# Altium schematic sheet ReiAccept_RaspberryPiZeroKeyboard__pcb_Old_AltiumDesigner__main.schdoc
size 519 x 360 mm
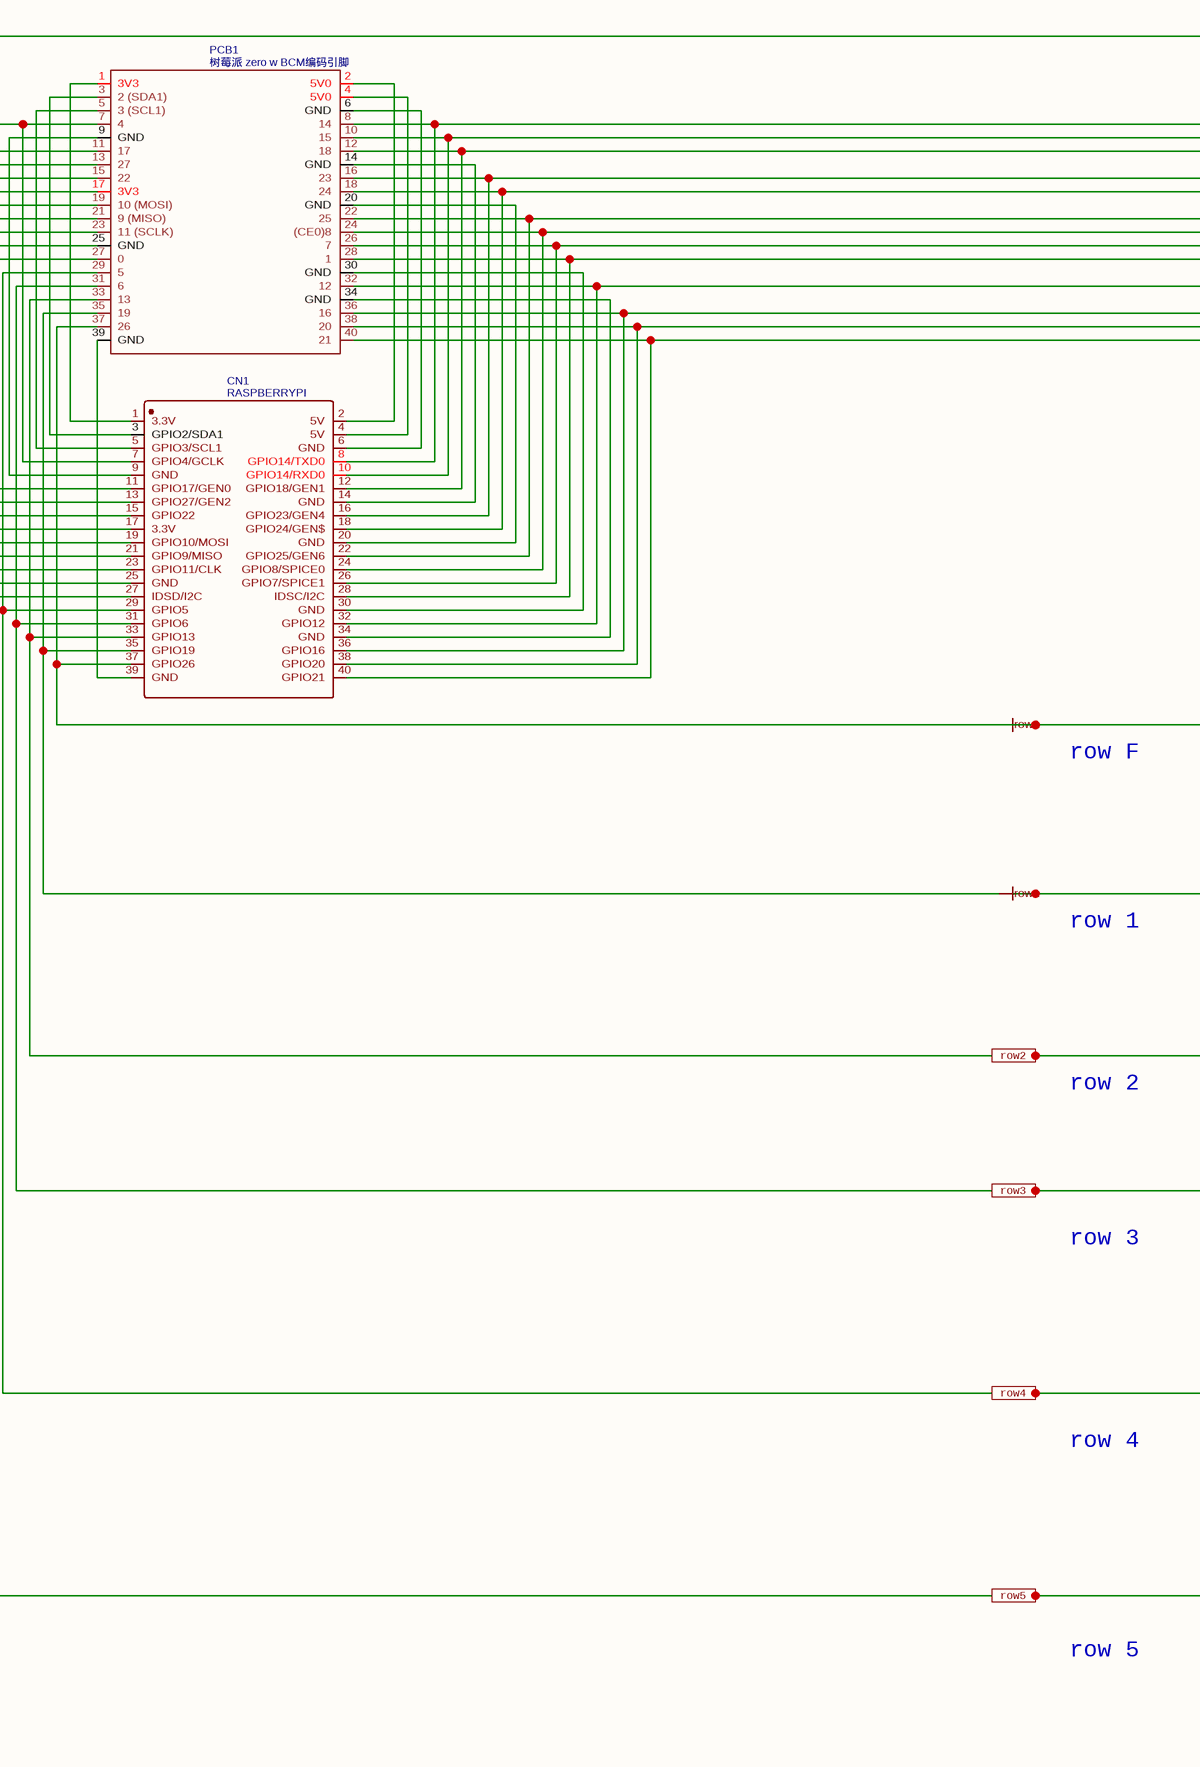
[diagram p0: ReiAccept_RaspberryPiZeroKeyboard__pcb_Old_AltiumDesigner__main.schdoc, left]
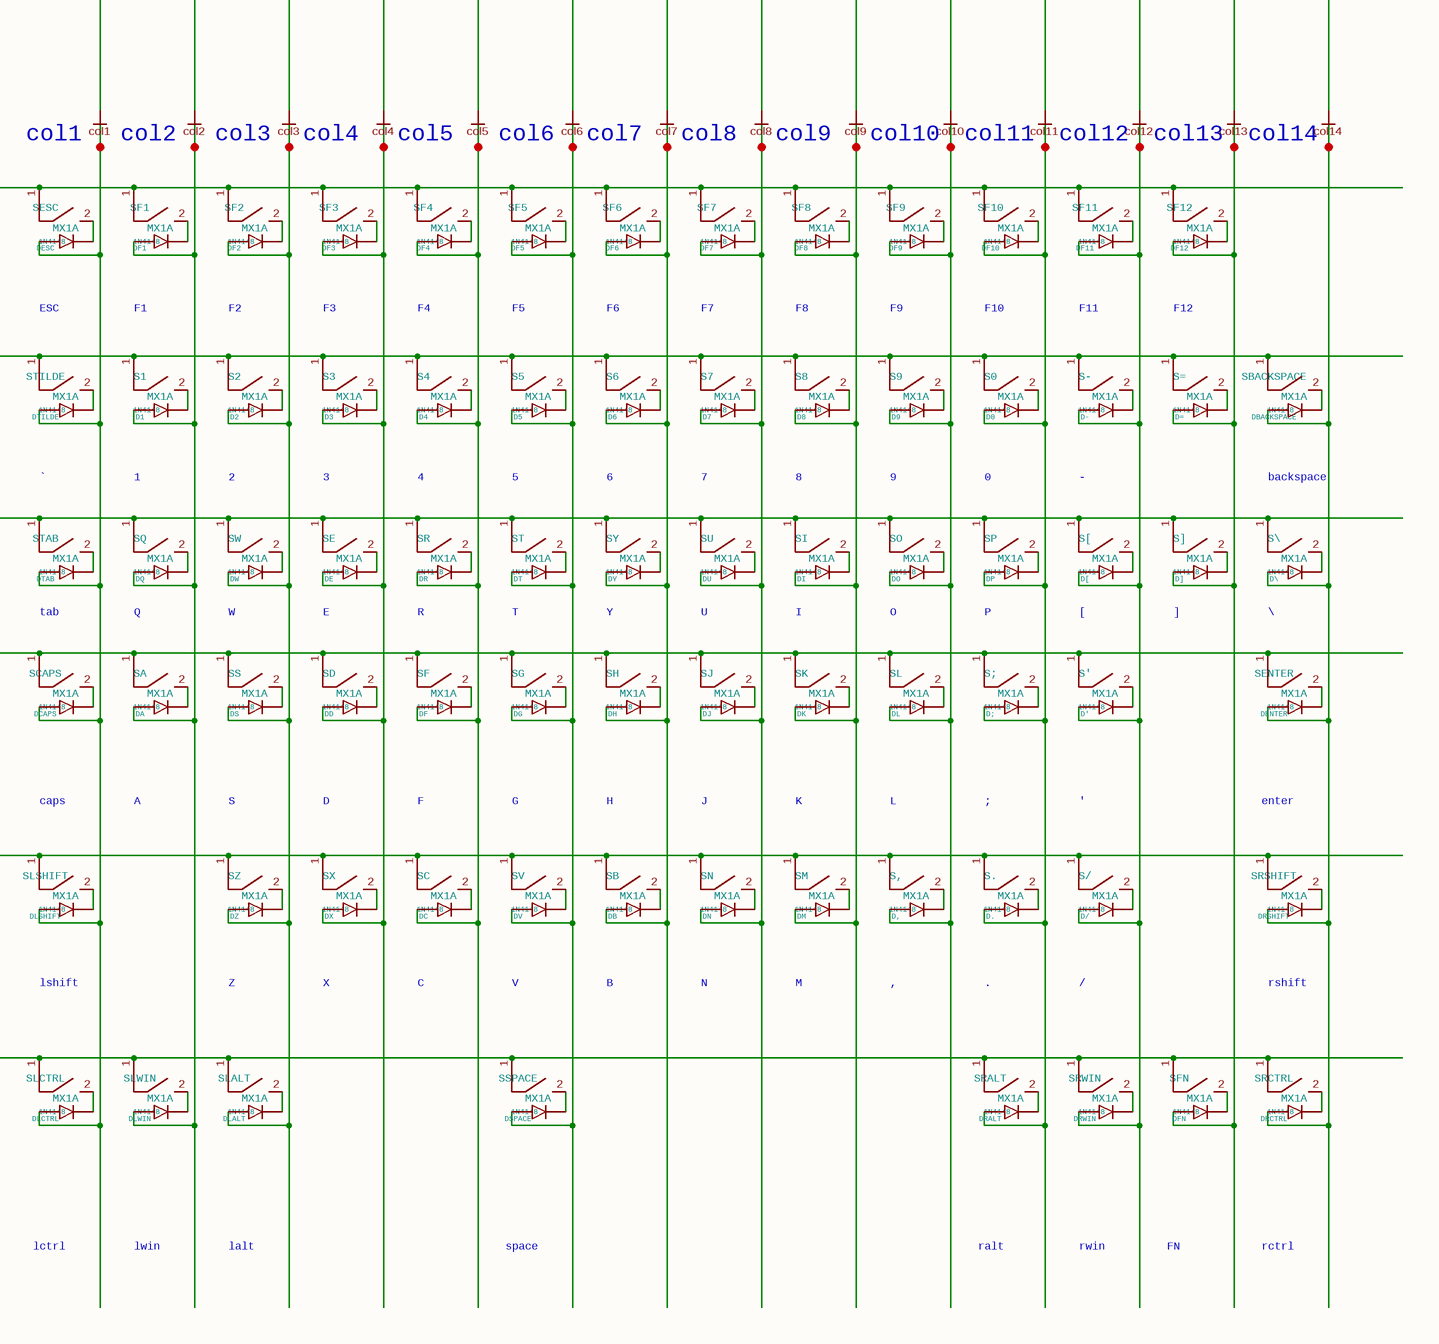
[diagram p1: ReiAccept_RaspberryPiZeroKeyboard__pcb_Old_AltiumDesigner__main.schdoc, right]

## Parts
CN1  RASPBERRYPI  [HDR-IDC-2.54-2X20P]
D0  1N4148  [0805D]
D1  1N4148  [0805D]
D2  1N4148  [0805D]
D3  1N4148  [0805D]
D4  1N4148  [0805D]
D5  1N4148  [0805D]
D6  1N4148  [0805D]
D7  1N4148  [0805D]
D8  1N4148  [0805D]
D9  1N4148  [0805D]
D'  1N4148  [0805D]
D,  1N4148  [0805D]
D-  1N4148  [0805D]
D.  1N4148  [0805D]
D/  1N4148  [0805D]
D;  1N4148  [0805D]
D=  1N4148  [0805D]
D[  1N4148  [0805D]
D\  1N4148  [0805D]
D]  1N4148  [0805D]
DA  1N4148  [0805D]
DB  1N4148  [0805D]
DBACKSPACE  1N4148  [0805D]
DC  1N4148  [0805D]
DCAPS  1N4148  [0805D]
DD  1N4148  [0805D]
DE  1N4148  [0805D]
DENTER  1N4148  [0805D]
DESC  1N4148  [0805D]
DF  1N4148  [0805D]
DF1  1N4148  [0805D]
DF2  1N4148  [0805D]
DF3  1N4148  [0805D]
DF4  1N4148  [0805D]
DF5  1N4148  [0805D]
DF6  1N4148  [0805D]
DF7  1N4148  [0805D]
DF8  1N4148  [0805D]
DF9  1N4148  [0805D]
DF10  1N4148  [0805D]
DF11  1N4148  [0805D]
DF12  1N4148  [0805D]
DFN  1N4148  [0805D]
DG  1N4148  [0805D]
DH  1N4148  [0805D]
DI  1N4148  [0805D]
DJ  1N4148  [0805D]
DK  1N4148  [0805D]
DL  1N4148  [0805D]
DLALT  1N4148  [0805D]
DLCTRL  1N4148  [0805D]
DLSHIFT  1N4148  [0805D]
DLWIN  1N4148  [0805D]
DM  1N4148  [0805D]
DN  1N4148  [0805D]
DO  1N4148  [0805D]
DP  1N4148  [0805D]
DQ  1N4148  [0805D]
DR  1N4148  [0805D]
DRALT  1N4148  [0805D]
DRCTRL  1N4148  [0805D]
DRSHIFT  1N4148  [0805D]
DRWIN  1N4148  [0805D]
DS  1N4148  [0805D]
DSPACE  1N4148  [0805D]
DT  1N4148  [0805D]
DTAB  1N4148  [0805D]
DTILDE  1N4148  [0805D]
DU  1N4148  [0805D]
DV  1N4148  [0805D]
DW  1N4148  [0805D]
DX  1N4148  [0805D]
DY  1N4148  [0805D]
DZ  1N4148  [0805D]
PCB1  树莓派 zero w BCM编码引脚  [RASPBERRY PI ZERO (FACE UP) OUTLINE]
S0  MX1A  [MX1A]
S1  MX1A  [MX1A]
S2  MX1A  [MX1A]
S3  MX1A  [MX1A]
S4  MX1A  [MX1A]
S5  MX1A  [MX1A]
S6  MX1A  [MX1A]
S7  MX1A  [MX1A]
S8  MX1A  [MX1A]
S9  MX1A  [MX1A]
S'  MX1A  [MX1A]
S,  MX1A  [MX1A]
S-  MX1A  [MX1A]
S.  MX1A  [MX1A]
S/  MX1A  [MX1A]
S;  MX1A  [MX1A]
S=  MX1A  [MX1A]
S[  MX1A  [MX1A]
S\  MX1A  [MX1A]
S]  MX1A  [MX1A]
SA  MX1A  [MX1A]
SB  MX1A  [MX1A]
SBACKSPACE  MX1A  [MX1A]
SC  MX1A  [MX1A]
SCAPS  MX1A  [MX1A]
SD  MX1A  [MX1A]
SE  MX1A  [MX1A]
SENTER  MX1A  [MX1A]
SESC  MX1A  [MX1A]
SF  MX1A  [MX1A]
SF1  MX1A  [MX1A]
SF2  MX1A  [MX1A]
SF3  MX1A  [MX1A]
SF4  MX1A  [MX1A]
SF5  MX1A  [MX1A]
SF6  MX1A  [MX1A]
SF7  MX1A  [MX1A]
SF8  MX1A  [MX1A]
SF9  MX1A  [MX1A]
SF10  MX1A  [MX1A]
SF11  MX1A  [MX1A]
SF12  MX1A  [MX1A]
SFN  MX1A  [MX1A_NO3D]
SG  MX1A  [MX1A]
SH  MX1A  [MX1A]
SI  MX1A  [MX1A]
SJ  MX1A  [MX1A]
SK  MX1A  [MX1A]
SL  MX1A  [MX1A]
SLALT  MX1A  [MX1A]
SLCTRL  MX1A  [MX1A]
SLSHIFT  MX1A  [MX1A]
SLWIN  MX1A  [MX1A]
SM  MX1A  [MX1A]
SN  MX1A  [MX1A]
SO  MX1A  [MX1A]
SP  MX1A  [MX1A]
SQ  MX1A  [MX1A]
SR  MX1A  [MX1A]
SRALT  MX1A  [MX1A]
SRCTRL  MX1A  [MX1A_NO3D]
SRSHIFT  MX1A  [MX1A]
SRWIN  MX1A  [MX1A]
SS  MX1A  [MX1A]
SSPACE  MX1A  [MX1A_NO3D]
ST  MX1A  [MX1A]
STAB  MX1A  [MX1A]
STILDE  MX1A  [MX1A]
SU  MX1A  [MX1A]
SV  MX1A  [MX1A]
SW  MX1A  [MX1A]
SX  MX1A  [MX1A]
SY  MX1A  [MX1A]
SZ  MX1A  [MX1A]

## Ports
row2 (in), row3 (in), row4 (in), row5 (in)

## Nets
col1: CN1.40(GPIO21) DCAPS.1(A) DESC.1(A) DLCTRL.1(A) DLSHIFT.1(A) DTAB.1(A) DTILDE.1(A) PCB1.40(21)
col2: CN1.38(GPIO20) D1.1(A) DA.1(A) DF1.1(A) DLWIN.1(A) DQ.1(A) PCB1.38(20)
col3: CN1.36(GPIO16) D2.1(A) DF2.1(A) DLALT.1(A) DS.1(A) DW.1(A) DZ.1(A) PCB1.36(16)
col4: CN1.32(GPIO12) D3.1(A) DD.1(A) DE.1(A) DF3.1(A) DX.1(A) PCB1.32(12)
col5: CN1.28(IDSC/I2C) D4.1(A) DC.1(A) DF.1(A) DF4.1(A) DR.1(A) PCB1.28(1)
col6: CN1.26(GPIO7/SPICE1) D5.1(A) DF5.1(A) DG.1(A) DSPACE.1(A) DT.1(A) DV.1(A) PCB1.26(7)
col7: CN1.24(GPIO8/SPICE0) D6.1(A) DB.1(A) DF6.1(A) DH.1(A) DY.1(A) PCB1.24((CE0)8)
col8: CN1.22(GPIO25/GEN6) D7.1(A) DF7.1(A) DJ.1(A) DN.1(A) DU.1(A) PCB1.22(25)
col9: CN1.18(GPIO24/GEN$) D8.1(A) DF8.1(A) DI.1(A) DK.1(A) DM.1(A) PCB1.18(24)
col10: CN1.16(GPIO23/GEN4) D9.1(A) D,.1(A) DF9.1(A) DL.1(A) DO.1(A) PCB1.16(23)
col11: CN1.12(GPIO18/GEN1) D0.1(A) D..1(A) D;.1(A) DF10.1(A) DP.1(A) DRALT.1(A) PCB1.12(18)
col12: CN1.10(GPIO14/RXD0) D'.1(A) D-.1(A) D/.1(A) D[.1(A) DF11.1(A) DRWIN.1(A) PCB1.10(15)
col13: CN1.8(GPIO14/TXD0) D=.1(A) D].1(A) DF12.1(A) DFN.1(A) PCB1.8(14)
col14: CN1.7(GPIO4/GCLK) D\.1(A) DBACKSPACE.1(A) DENTER.1(A) DRCTRL.1(A) DRSHIFT.1(A) PCB1.7(4)
row1: CN1.35(GPIO19) CN1.37(GPIO26) PCB1.35(19) PCB1.37(26) S0.1 S1.1 S2.1 S3.1 S4.1 S5.1 S6.1 S7.1 S8.1 S9.1 S-.1 S=.1 SBACKSPACE.1 SESC.1 SF1.1 SF2.1 SF3.1 SF4.1 SF5.1 SF6.1 SF7.1 SF8.1 SF9.1 SF10.1 SF11.1 SF12.1 STILDE.1
row2: CN1.33(GPIO13) PCB1.33(13) S[.1 S\.1 S].1 SE.1 SI.1 SO.1 SP.1 SQ.1 SR.1 ST.1 STAB.1 SU.1 SW.1 SY.1 ; port row2
row3: CN1.31(GPIO6) PCB1.31(6) S'.1 S;.1 SA.1 SCAPS.1 SD.1 SENTER.1 SF.1 SG.1 SH.1 SJ.1 SK.1 SL.1 SS.1 ; port row3
row4: CN1.29(GPIO5) PCB1.29(5) S,.1 S..1 S/.1 SB.1 SC.1 SLSHIFT.1 SM.1 SN.1 SRSHIFT.1 SV.1 SX.1 SZ.1 ; port row4
row5: CN1.27(IDSD/I2C) PCB1.27(0) SFN.1 SLALT.1 SLCTRL.1 SLWIN.1 SRALT.1 SRCTRL.1 SRWIN.1 SSPACE.1 ; port row5
NetCN1_1: CN1.1(3.3V) PCB1.1(3V3)
NetCN1_2: CN1.2(5V) PCB1.2(5V0)
NetCN1_3: CN1.3(GPIO2/SDA1) PCB1.3(2_(SDA1))
NetCN1_4: CN1.4(5V) PCB1.4(5V0)
NetCN1_5: CN1.5(GPIO3/SCL1) PCB1.5(3_(SCL1))
NetCN1_6: CN1.6(GND) PCB1.6(GND)
NetCN1_9: CN1.9(GND) PCB1.9(GND)
NetCN1_11: CN1.11(GPIO17/GEN0) PCB1.11(17)
NetCN1_13: CN1.13(GPIO27/GEN2) PCB1.13(27)
NetCN1_14: CN1.14(GND) PCB1.14(GND)
NetCN1_15: CN1.15(GPIO22) PCB1.15(22)
NetCN1_17: CN1.17(3.3V) PCB1.17(3V3)
NetCN1_19: CN1.19(GPIO10/MOSI) PCB1.19(10_(MOSI))
NetCN1_20: CN1.20(GND) PCB1.20(GND)
NetCN1_21: CN1.21(GPIO9/MISO) PCB1.21(9_(MISO))
NetCN1_23: CN1.23(GPIO11/CLK) PCB1.23(11_(SCLK))
NetCN1_25: CN1.25(GND) PCB1.25(GND)
NetCN1_30: CN1.30(GND) PCB1.30(GND)
NetCN1_34: CN1.34(GND) PCB1.34(GND)
NetCN1_39: CN1.39(GND) PCB1.39(GND)
NetD0_2: D0.2(K) S0.2
NetD1_2: D1.2(K) S1.2
NetD2_2: D2.2(K) S2.2
NetD3_2: D3.2(K) S3.2
NetD4_2: D4.2(K) S4.2
NetD5_2: D5.2(K) S5.2
NetD6_2: D6.2(K) S6.2
NetD7_2: D7.2(K) S7.2
NetD8_2: D8.2(K) S8.2
NetD9_2: D9.2(K) S9.2
NetD'_2: D'.2(K) S'.2
NetD,_2: D,.2(K) S,.2
NetD-_2: D-.2(K) S-.2
NetD._2: D..2(K) S..2
NetD/_2: D/.2(K) S/.2
NetD;_2: D;.2(K) S;.2
NetD=_2: D=.2(K) S=.2
NetD[_2: D[.2(K) S[.2
Net~{D}_2: D\.2(K) S\.2
NetD]_2: D].2(K) S].2
NetDA_2: DA.2(K) SA.2
NetDB_2: DB.2(K) SB.2
NetDBACKSPACE_2: DBACKSPACE.2(K) SBACKSPACE.2
NetDC_2: DC.2(K) SC.2
NetDCAPS_2: DCAPS.2(K) SCAPS.2
NetDD_2: DD.2(K) SD.2
NetDE_2: DE.2(K) SE.2
NetDENTER_2: DENTER.2(K) SENTER.2
NetDESC_2: DESC.2(K) SESC.2
NetDF1_2: DF1.2(K) SF1.2
NetDF2_2: DF2.2(K) SF2.2
NetDF3_2: DF3.2(K) SF3.2
NetDF4_2: DF4.2(K) SF4.2
NetDF5_2: DF5.2(K) SF5.2
NetDF6_2: DF6.2(K) SF6.2
NetDF7_2: DF7.2(K) SF7.2
NetDF8_2: DF8.2(K) SF8.2
NetDF9_2: DF9.2(K) SF9.2
NetDF10_2: DF10.2(K) SF10.2
NetDF11_2: DF11.2(K) SF11.2
NetDF12_2: DF12.2(K) SF12.2
NetDF_2: DF.2(K) SF.2
NetDFN_2: DFN.2(K) SFN.2
NetDG_2: DG.2(K) SG.2
NetDH_2: DH.2(K) SH.2
NetDI_2: DI.2(K) SI.2
NetDJ_2: DJ.2(K) SJ.2
NetDK_2: DK.2(K) SK.2
NetDL_2: DL.2(K) SL.2
NetDLALT_2: DLALT.2(K) SLALT.2
NetDLCTRL_2: DLCTRL.2(K) SLCTRL.2
NetDLSHIFT_2: DLSHIFT.2(K) SLSHIFT.2
NetDLWIN_2: DLWIN.2(K) SLWIN.2
NetDM_2: DM.2(K) SM.2
NetDN_2: DN.2(K) SN.2
NetDO_2: DO.2(K) SO.2
NetDP_2: DP.2(K) SP.2
NetDQ_2: DQ.2(K) SQ.2
NetDR_2: DR.2(K) SR.2
NetDRALT_2: DRALT.2(K) SRALT.2
NetDRCTRL_2: DRCTRL.2(K) SRCTRL.2
NetDRSHIFT_2: DRSHIFT.2(K) SRSHIFT.2
NetDRWIN_2: DRWIN.2(K) SRWIN.2
NetDS_2: DS.2(K) SS.2
NetDSPACE_2: DSPACE.2(K) SSPACE.2
NetDT_2: DT.2(K) ST.2
NetDTAB_2: DTAB.2(K) STAB.2
NetDTILDE_2: DTILDE.2(K) STILDE.2
NetDU_2: DU.2(K) SU.2
NetDV_2: DV.2(K) SV.2
NetDW_2: DW.2(K) SW.2
NetDX_2: DX.2(K) SX.2
NetDY_2: DY.2(K) SY.2
NetDZ_2: DZ.2(K) SZ.2

## Notes on the sheet
- col1
- col2
- col3
- col4
- col5
- col6
- col7
- col8
- col9
- col10
- col11
- col12
- col13
- col14
- row F
- ESC
- F1
- F2
- F3
- F4
- F5
- F6
- F7
- F8
- F9
- F10
- F11
- F12
- row 1
- `
- 1
- 2
- 3
- 4
- 5
- 6
- 7
- 8
- 9
- 0
- -
- backspace
- row 2
- tab
- Q
- W
- E
- R
- T
- Y
- U
- I
- O
- P
- [
- ]
- \
- row 3
- caps
- A
- S
- D
- F
- G
- H
- J
- K
- L
- ;
- '
- enter
- row 4
- lshift
- Z
- X
- C
- V
- B
- N
- M
- ,
- .
- /
- rshift
- row 5
- lctrl
- lwin
- lalt
- space
- ralt
- rwin
- FN
- rctrl

## Library data of the parts
CN1 = RASPBERRYPI: BOM_LCSC Assembly: No; Contributor: maigu; spicePre: X; BOM_Supplier Part: VNH5019; BOM_Supplier: Digi-Key; BOM_Manufacturer: RASPBERRY; BOM_Manufacturer Part: RASPBERRY; spiceSymbolName: RASPBERRYPI
D0-D9 D' D, D- D. D/ D; D= D[ D\ D] DA DB DBACKSPACE DC DCAPS DD DE DENTER DESC DF DF1-DF12 DFN DG DH DI DJ DK DL DLALT DLCTRL DLSHIFT DLWIN DM DN DO DP DQ DR DRALT DRCTRL DRSHIFT DRWIN DS DSPACE DT DTAB DTILDE DU DV DW DX DY DZ = 1N4148: Vendor: DC Components; Product: CD4148WS(0805C); Supplier: TME; Supplier Symbol: 1N4148-0805
PCB1 = 树莓派 zero w BCM编码引脚: BOM_Manufacturer: raspberry; description: Raspberry Pi Zero; sourceId: a8qICUO6o; Contributor: luck88431844; timeStamp: 1464116511; BOM_Supplier: raspberry; spicePre: P; spiceSymbolName: 树莓派 zero w BCM编码引脚